# Altium project Car_PCB.PrjPcb
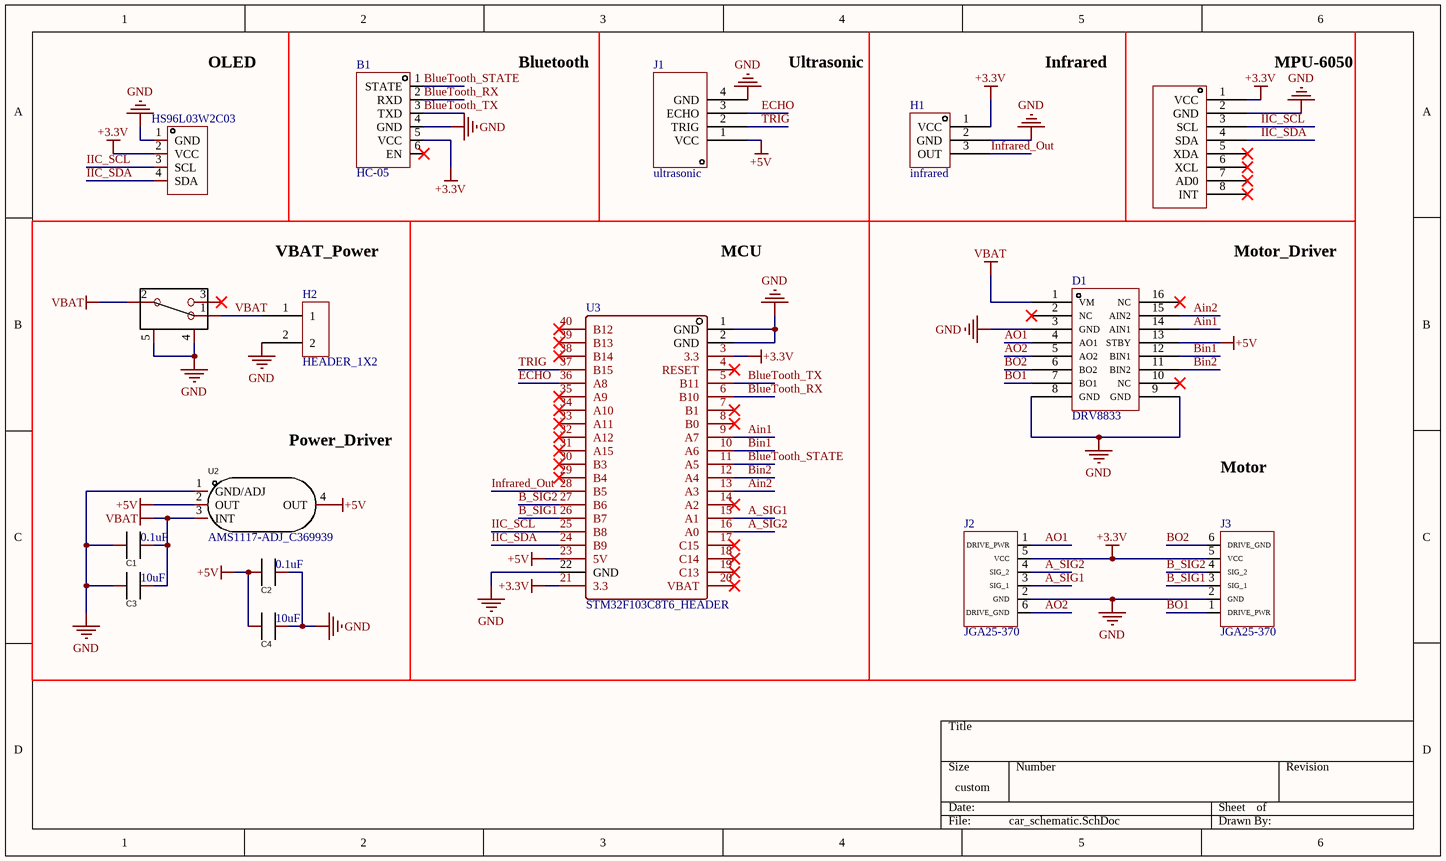
[diagram p0: car_schematic.SchDoc]
1 sheet, 16 parts. Net scope: global (net labels, ports and power ports of the same name join across sheets).
Board file: car_PCB.PcbDoc

## Sheet car_schematic.SchDoc
size 270 x 160 mm; SheetNumber: 1; SheetTotal: 1

### Parts
B1  HC-05  [HC-05_HEADER]
C1  0.1uF  [C0603]
C2  0.1uF  [C0603]
C3  10uF  [C0603]
C4  10uF  [C0603]
D1  DRV8833  [DRV8833_HEADER]
H1  infrared  [RISYM-001_HEADER]
H2  HEADER_1X2  [HEADER_1X2]
J1  ultrasonic  [HC-SR04_HEADER]
J2  JGA25-370  [JGA25-370_HEADER]
J3  JGA25-370  [JGA25-370_HEADER]
SW1  SS-12F44-G5_C136718  [SW-TH_SS-12F44-GX]  (value not drawn)
U1  MPU-6050  [MPU-6050_HEADER]  (value not drawn)
U2  AMS1117-ADJ_C369939  [SOT-223_L6.5-W3.5-P2.30-LS7.0-BR]
U3  STM32F103C8T6_HEADER  [STM32F103C8T6_HEADER]
U4  HS96L03W2C03  [OLED-TH_L27.8-W27.2-P2.54_C9900033791]

### Nets
+3.3V: B1.5(VCC) H1.1(VCC) J2.5(VCC) J3.5(VCC) U1.1(VCC) U3.3(3.3) U3.21(3.3) U4.2(VCC)
+5V: C2.1 C4.1 D1.13(STBY) J1.1(VCC) U2.2(OUT) U2.4(OUT) U3.23(5V)
GND: B1.4(GND) C1.1 C2.2 C3.1 C4.2 D1.3(GND) D1.8(GND) D1.9(GND) H1.2(GND) H2.2 J1.4(GND) J2.2(GND) J3.2(GND) SW1.4 SW1.5 U1.2(GND) U2.1(GND/ADJ) U3.1(GND) U3.2(GND) U3.22(GND) U4.1(GND)
VBAT: C1.2 C3.2 D1.1(VM) H2.1 SW1.1 SW1.2 U2.3(INT)
A_SIG1: J2.3(SIG_1) U3.15(A1)
A_SIG2: J2.4(SIG_2) U3.16(A0)
Ain1: D1.14(AIN1) U3.9(A7)
Ain2: D1.15(AIN2) U3.13(A3)
AO1: D1.4(AO1) J2.1(DRIVE_PWR)
AO2: D1.5(AO2) J2.6(DRIVE_GND)
B_SIG1: J3.3(SIG_1) U3.26(B7)
B_SIG2: J3.4(SIG_2) U3.27(B6)
Bin1: D1.12(BIN1) U3.10(A6)
Bin2: D1.11(BIN2) U3.12(A4)
BlueTooth_RX: B1.2(RXD) U3.6(B10)
BlueTooth_STATE: B1.1(STATE) U3.11(A5)
BlueTooth_TX: B1.3(TXD) U3.5(B11)
BO1: D1.7(BO1) J3.1(DRIVE_PWR)
BO2: D1.6(BO2) J3.6(DRIVE_GND)
ECHO: J1.3(ECHO) U3.36(A8)
IIC_SCL: U1.3(SCL) U3.25(B8) U4.3(SCL)
IIC_SDA: U1.4(SDA) U3.24(B9) U4.4(SDA)
Infrared_Out: H1.3(OUT) U3.28(B5)
TRIG: J1.2(TRIG) U3.37(B15)

Not connected (* = marked no-connect by the designer): B1 6(EN)*; D1 2(NC)* 10(NC)* 16(NC)*; SW1 3*; U1 5(XDA)* 6(XCL)* 7(AD0)* 8(INT)*; U3 4(RESET)* 7(B1)* 8(B0)* 14(A2)* 17(C15)* 18(C14)* 19(C13)* 20(VBAT)* 29(B4)* 30(B3)* 31(A15)* 32(A12)* 33(A11)* 34(A10)* 35(A9)* 38(B14)* 39(B13)* 40(B12)*

### Notes on the sheet
- OLED
- Bluetooth
- Ultrasonic
- Infrared
- MPU-6050
- VBAT_Power
- MCU
- Motor_Driver
- (near U2) Power_Driver
- Motor

### Library data of the parts
B1 = HC-05: 蓝牙模块 VCC接3.3
C1-C4 = C0603: Manufacturer: SAMSUNG(三星); Name: 1uF; Symbol: CL10A105KB8NNNC; Add into BOM: yes; Value: 1uF; Tolerance: ±10%; Voltage Rated: 50V; Temperature Coefficient: X5R; Device: CL10A105KB8NNNC; LCSC Part Name: 1uF ±10% 50V; Supplier Part: C15849; Manufacturer Part: CL10A105KB8NNNC; Supplier Footprint: 0603; JLCPCB Part Class: Basic Part; Datasheet: https://atta.szlcsc.com/upload/public/pdf/source/20160103/1457707679084.pdf; Supplier: LCSC; Convert to PCB: yes
D1 = DRV8833: 电机驱动
H1 = RISYM-001: 红外循迹模块
J1 = HC-SR04: 超声波模块 Pin Header
J2 J3 = JGA25-370: JGA25-370 直流减速电机
SW1 = SS-12F44-G5_C136718: 滑动开关G5; Manufacturer: 韩国韩荣; Add into BOM: yes; Circuit: 单刀双掷; Mechanical Life: 5千次; Actuator Style: 矩形柱状; Pin Style: PC引脚; Switch Height: 11mm; Name: SS-12F44-G5; Symbol: SS-12F44-G5; Device: SS-12F44-G5_C136718; LCSC Part Name: 直插双档 滑动开关; Supplier Part: C136718; Manufacturer Part: SS-12F44-G5; Supplier Footprint: 插件; JLCPCB Part Class: Extended Part; Datasheet: https://atta.szlcsc.com/upload/public/pdf/source/20171123/C136718_15114108132111137440.pdf; Supplier: LCSC; Convert to PCB: yes; Current Rating (DC): -; Voltage Rating (DC): -; Current Rating (AC): -; Voltage Rating (AC): -; Mounting Style: 直插; Operating Temperature: -25℃~+70℃
U1 = MPU-6050: Pin Header; Manufacturer: TDK InvenSense(应美盛); Symbol: MPU-6050_C24112; Add into BOM: yes; Name: MPU-6050; Device: MPU-6050; LCSC Part Name: MPU-6050; Supplier Part: C24112; Manufacturer Part: MPU-6050; Supplier Footprint: QFN-24(4x4); JLCPCB Part Class: Basic Part; Datasheet: https://atta.szlcsc.com/upload/public/pdf/source/20140425/1457707046159.pdf; Supplier: LCSC; Convert to PCB: yes
U2 = AMS1117-ADJ_C369939: 电源稳压芯片; Manufacturer: KEXIN(科信); Add into BOM: yes; Output Type: 可调; Output Polarity: 正; Number of Outputs: 1; Maximum Input Voltage: 18V; Output Voltage: 1.2V~5V; Dropout Voltage: 1.6V@(1A); Output Current: 1A; Power Supply Rejection Ratio (PSRR): 70dB; Name: AMS1117-ADJ; Symbol: AMS1117-ADJ_C369939; Device: AMS1117-ADJ_C369939; LCSC Part Name: AMS1117-ADJ; Supplier Part: C369939; Manufacturer Part: AMS1117-ADJ; Supplier Footprint: SOT-223; JLCPCB Part Class: Extended Part; Datasheet: https://atta.szlcsc.com/upload/public/pdf/source/20210413/C369939_FEF4C4218FA2F17782ADF56797D6F897.pdf; Supplier: LCSC; Convert to PCB: yes
U3 = STM32F103C8T6_HEADER: Pin Header
U4 = HS96L03W2C03: I2C OLED 0.96; Manufacturer: HS(汉昇); Add into BOM: yes; Name: HS96L03W2C03; Symbol: HS96L03W2C03; Device: HS96L03W2C03; LCSC Part Name: 0.96寸OLED显示屏窄白光IIC; Supplier Part: C5248080; Manufacturer Part: HS96L03W2C03; Supplier Footprint: -; JLCPCB Part Class: Extended Part; Supplier: LCSC; Convert to PCB: yes